# EasyEDA Pro project stm32 Project.eprj

# Schematic Schematic1
Create Date: 2022-09-03; Page Name: stm32; Project Name: stm32 Project; Schematic Name: Schematic1; Update Date: 2022-09-03
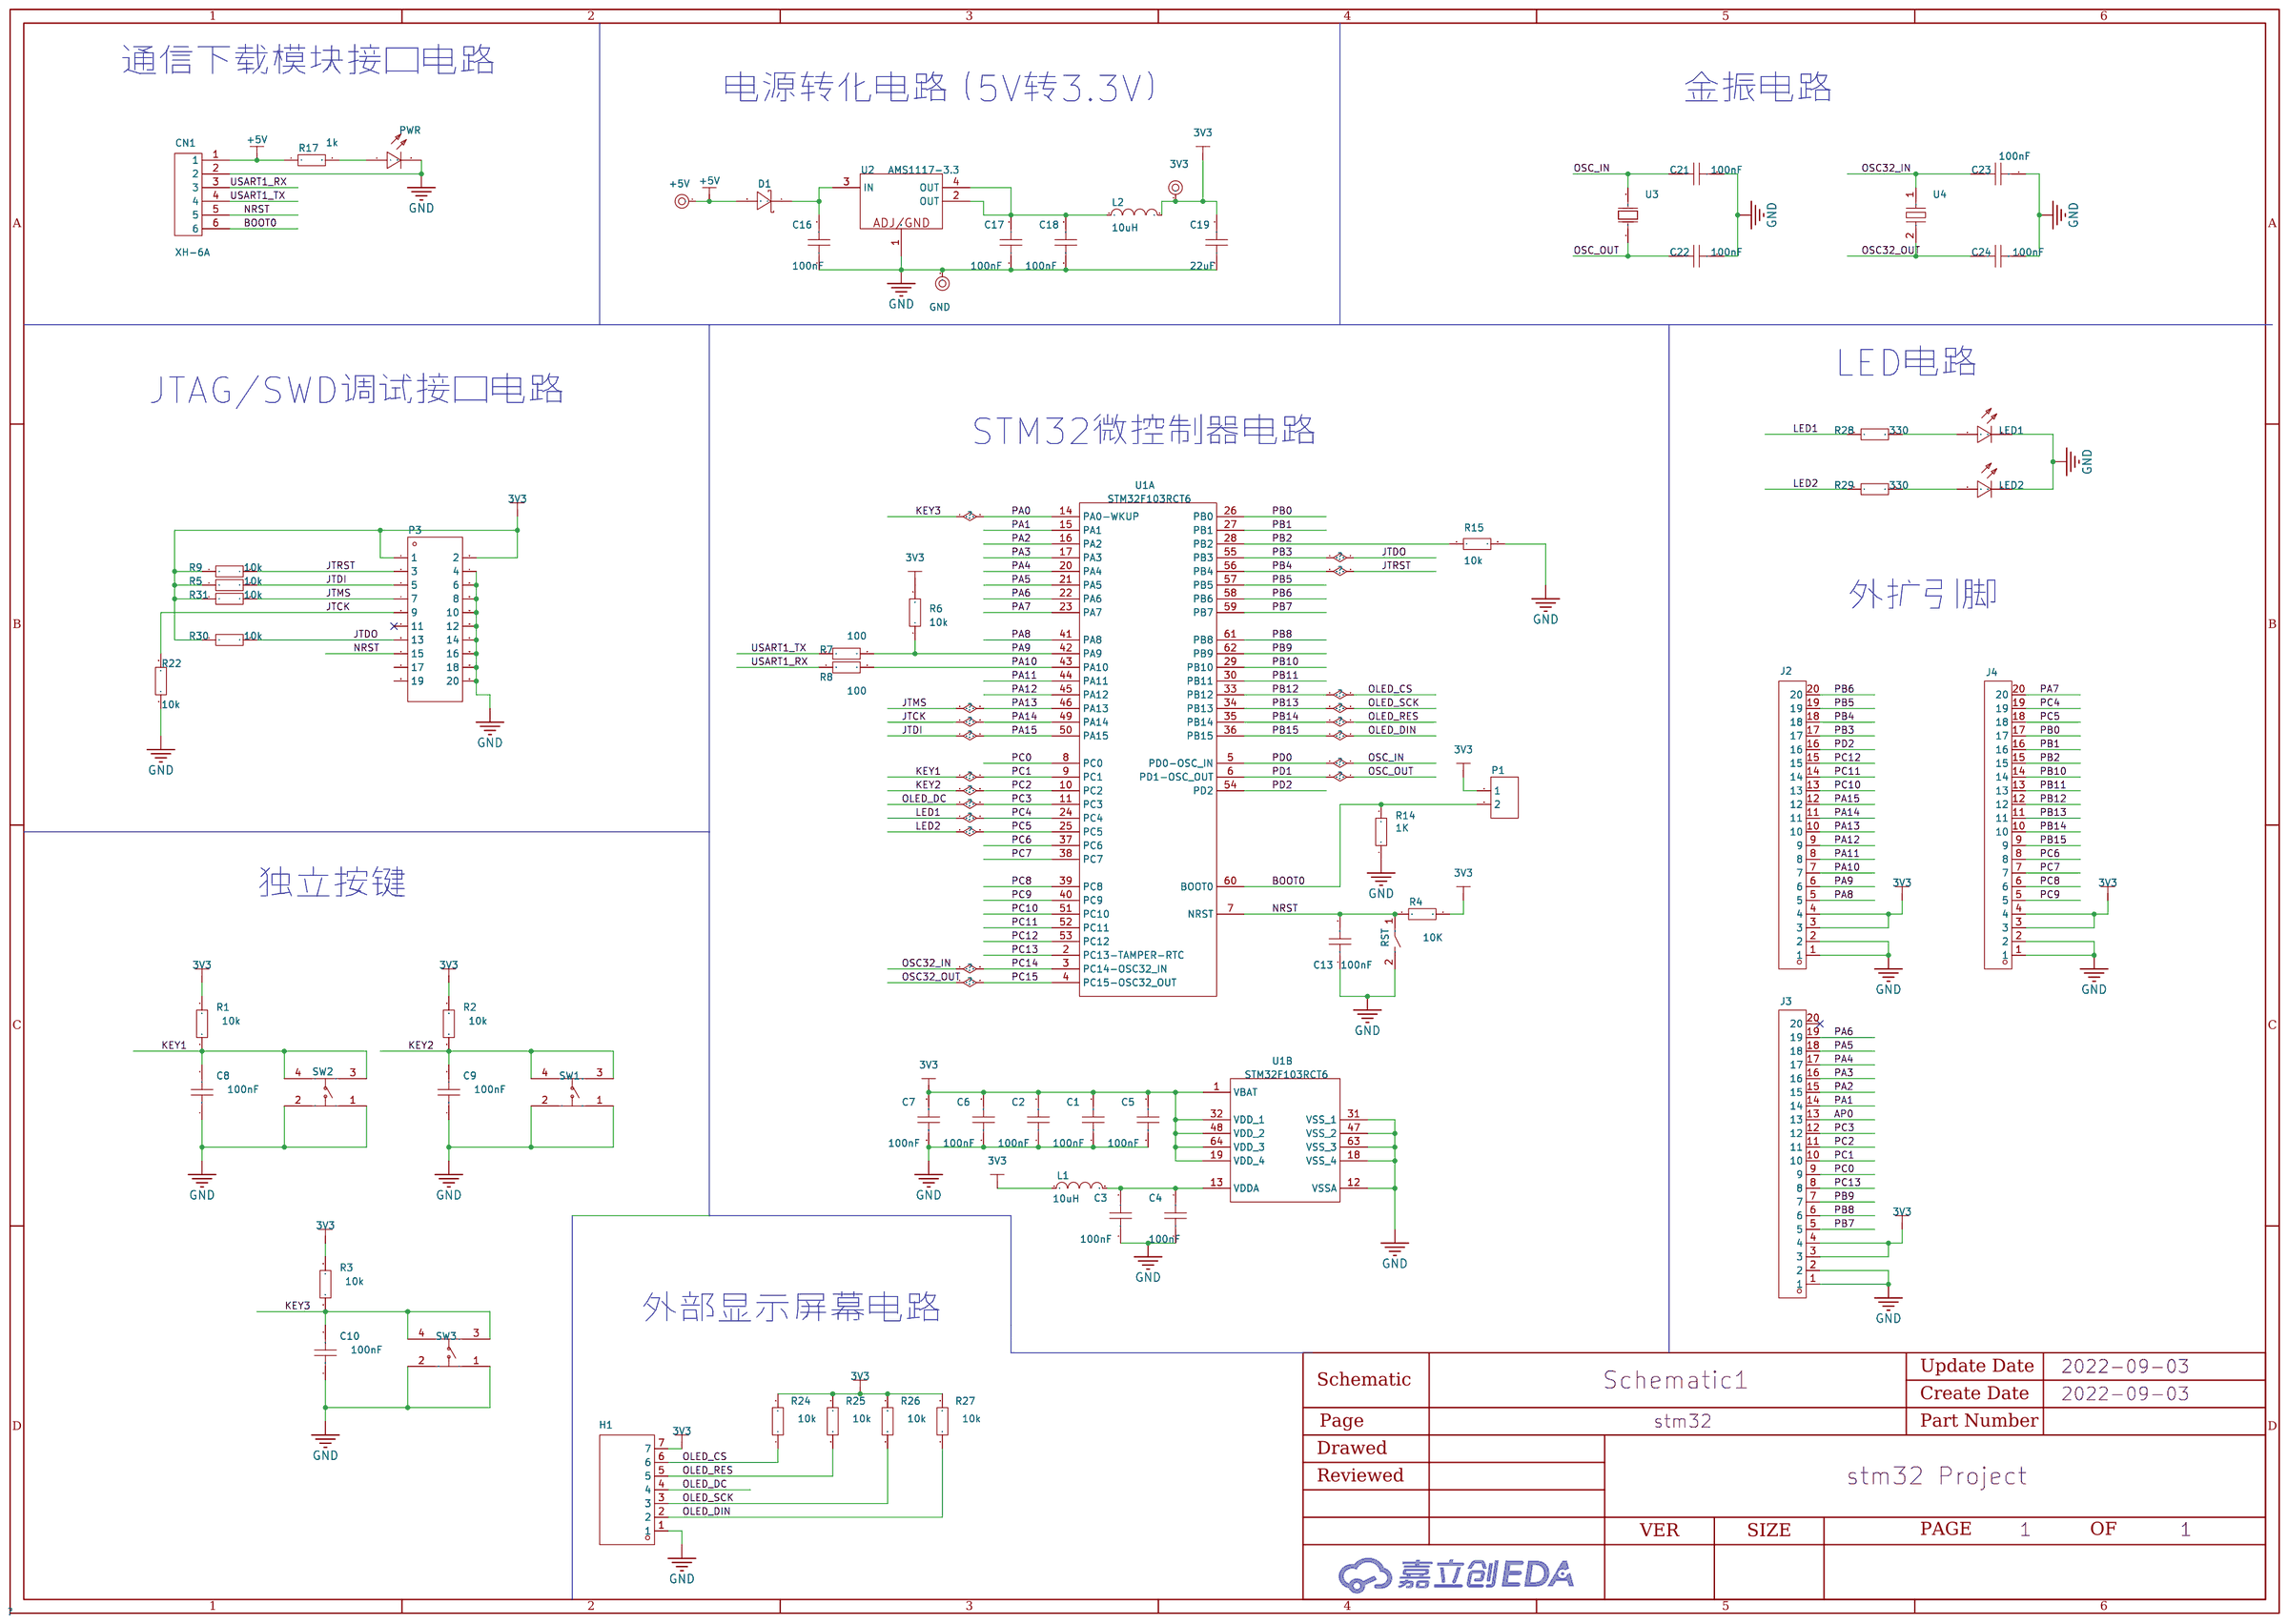
[diagram p0: schematic sheet]

## Parts
3V3  5013  [TESTPOINT-TH_BD3.2-D2.0]
+5V  5013  [TESTPOINT-TH_BD3.2-D2.0]
C1  100nF  [C0603]
C2  100nF  [C0603]
C3  100nF  [C0603]
C4  100nF  [C0603]
C5  100nF  [C0603]
C6  100nF  [C0603]
C7  100nF  [C0603]
C8  100nF  [C0603]
C9  100nF  [C0603]
C10  100nF  [C0603]
C13  100nF  [C0603]
C16  100nF  [C0603]
C17  100nF  [C0603]
C18  100nF  [C0603]
C19  22uF  [C0603]
C21  100nF  [C0603]
C22  100nF  [C0603]
C23  100nF  [C0603]
C24  100nF  [C0603]
CN1  XH-6A  [CONN-TH_6P-P2.50_XH-6A]
D1  SS220  [SMA_L4.4-W2.8-LS5.4-RD]
GND  5013  [TESTPOINT-TH_BD3.2-D2.0]
H1  A2541HWV-7P  [HDR-TH_7P-P2.54-V_A2541HWV-7P]
J2  2.54-1*20P直针  [HDR-TH_20P-P2.54-V-M-1]
J3  2.54-1*20P直针  [HDR-TH_20P-P2.54-V-M-1]
J4  2.54-1*20P直针  [HDR-TH_20P-P2.54-V-M-1]
L1  10uH  [L0603]
L2  10uH  [L0603]
LED1  19-217/GHC-YR1S2/3T  [LED0603-R-RD]
LED2  19-217/GHC-YR1S2/3T  [LED0603-R-RD]
P1  2.54-1*2P母  [HDR-TH_2P-P2.54-V-F]
P3  2.54-2*10P简牛  [IDC-TH_20P-P2.54-V-R2-C10-S2.54_1]
PWR  17-21SURC/S530-A3/TR8  [LED0805-R-RD]
R1  10k  [R0603]
R2  10k  [R0603]
R3  10k  [R0603]
R4  10K  [R0603]
R5  10k  [R0603]
R6  10k  [R0603]
R7  100  [R0603]
R8  100  [R0603]
R9  10k  [R0603]
R14  1K  [R0603]
R15  10k  [R0603]
R17  1k  [R0603]
R22  10k  [R0603]
R24  10k  [R0603]
R25  10k  [R0603]
R26  10k  [R0603]
R27  10k  [R0603]
R28  330  [R0603]
R29  330  [R0603]
R30  10k  [R0603]
R31  10k  [R0603]
RST  YTSB019A0251601B  [SW-SMD_L6.0-W4.0-LS7.3-L]
SW1  K2-6645SP-Q4SC-04  [KEY-SMD_4P-L6.0-W6.0-P4.50-LS9.0]
SW2  K2-6645SP-Q4SC-04  [KEY-SMD_4P-L6.0-W6.0-P4.50-LS9.0]
SW3  K2-6645SP-Q4SC-04  [KEY-SMD_4P-L6.0-W6.0-P4.50-LS9.0]
U1  STM32F103RCT6  [LQFP-64_L10.0-W10.0-P0.50-LS12.0-TL]  (sections 1,2)
U2  AMS1117-3.3  [SOT-223-3_L6.4-W3.5-P2.30-LS7.0-BR]
U3  8MHz  [CRYSTAL-SMD_L6.0-W3.5]
U4  32.768K/12.5PF  [CRYSTAL-SMD_L3.2-W1.5-1]

## Library data of the parts
3V3 +5V GND = 5013: LCSC Part Name: 测试点; Supplier Part: C2906767; Manufacturer: Keystone; Datasheet: https://atta.szlcsc.com/upload/public/pdf/source/20211102/6B22E044790764C1185B316144A1F5B8.pdf; Supplier: LCSC
C1-C10 C13 C16-C19 C21-C24 = CC0603KRX7R9BB104: 容值:100nF;精度:±10%;额定电压:50V;材质(温度系数):X7R;; LCSC Part Name: 100nF ±10% 50V; Supplier Part: C14663; Manufacturer: YAGEO(国巨); Supplier Footprint: 0603; JLCPCB Part Class: Basic Part; Datasheet: https://atta.szlcsc.com/upload/public/pdf/source/20170116/1484561234239.pdf; Supplier: LCSC; Tolerance: ±10%; Voltage Rated: 50V; Temperature Coefficient: X7R
CN1 = XH-6A_1: 参考系列:XH;间距:2.5mm;插针结构:1x6P;排数:1;每排PIN数:6;行距:-;安装方式:-;触头材质:-;; LCSC Part Name: XH-6A,6P,脚距2.5mm,直插 直插; Supplier Part: C5663; Manufacturer: BOOMELE(博穆精密); Supplier Footprint: 插件,P=2.5mm; Datasheet: https://atta.szlcsc.com/upload/public/pdf/source/20151222/1457707648819.pdf; Supplier: LCSC; Reference Series: XH; Pitch: 2.5mm; Pins Structure: 1x6P; Number of Rows: 1; Number of PINs Per Row: 6
D1 = SS220: 直流反向耐压(Vr):200V;平均整流电流(Io):2A;正向压降(Vf):550mV@2A;; LCSC Part Name: 200V 2A 550mV@2A; Supplier Part: C169420; Manufacturer: 晶导微电子; Supplier Footprint: SMA(DO-214AC); Datasheet: https://atta.szlcsc.com/upload/public/pdf/source/20180316/6D53E89B2A4F823A771FF464E8688D75.pdf; Supplier: LCSC; Reverse Voltage (Vr): 200V; Average Rectified Current (Io): 2A; Forward Voltage (Vf@If): 550mV@2A
H1 = A2541HWV-7P: 间距:2.54mm;总孔位数:7;排数:1;插孔结构:1x7P;行距:-;安装类型:直插;塑高:-;触头材质:黄铜;触头镀层:金;; LCSC Part Name: 2.54mm 1x7P; Supplier Part: C225504; Manufacturer: CJT(长江连接器); Supplier Footprint: 直插,P=2.54mm; Datasheet: https://atta.szlcsc.com/upload/public/pdf/source/20180509/C225504_4BDD47D2C090B41BD9BEC6AFDA509326.pdf; Supplier: LCSC; Pitch: 2.54mm; Number of Holes: 7; Number of Rows: 1; Holes Structure: 1x7P; Mounting Type: 直插; Contact Material: 黄铜; Contact Plating: 金
J2-J4 = 2.54-1*20P直针: 间距:2.54mm;总PIN位数:20;排数:1;插针结构:1x20P;行距:-;安装类型:直插;圆针/方针:方针;额定电流:3A;额定电压:-;配合针长度:-;塑高:-;端接针长度:-;触头材质:黄铜;触头镀层:-;工作温度范围:-40~+105;颜色:黑色;; LCSC Part Name: 2.54mm 1x20P 直插 方针; Supplier Part: C50981; Manufacturer: BOOMELE(博穆精密); Supplier Footprint: 插件,P=2.54mm; JLCPCB Part Class: Extended Part; Datasheet: https://atta.szlcsc.com/upload/public/pdf/source/20151109/1457707571495.pdf; Supplier: LCSC; Pitch: 2.54mm; Number of Pins: 20; Number of Rows: 1; Pin Structure: 1x20P; Mounting Type: 直插; Circluar Pins/Square Pins: 方针; Current Rating (Max): 3A; Contact Material: 黄铜; Operating Temperature Range: -40~+105; Color: 黑色
L1 L2 = SDFL1608S100KTF: 额定电流:3mA;电感值:10uH;精度:±10%;直流电阻(DCR):1.85;; LCSC Part Name: 10uH ±10%; Supplier Part: C1035; Manufacturer: Sunlord(顺络); Supplier Footprint: 0603; JLCPCB Part Class: Basic Part; Datasheet: https://atta.szlcsc.com/upload/public/pdf/source/20140222/1457706791092.pdf; Supplier: LCSC; Rated Current: 3mA; Tolerance: ±10%; DC Resistance (DCR): 1.85
LED1 LED2 = 19-217/GHC-YR1S2/3T: 照明颜色:翠绿;色温 - CCT（K）:-;主波长/色坐标:520~535nm;; LCSC Part Name: 翠绿LED; Supplier Part: C72043; Manufacturer: EVERLIGHT(台湾亿光); Supplier Footprint: 0603; JLCPCB Part Class: Basic Part; Datasheet: https://atta.szlcsc.com/upload/public/pdf/source/20160507/1462613613780.pdf; Supplier: LCSC; Mounting Type: 表面贴装; Illumination Color: 翠绿; Luminous Intensity (IF=20mA): 112~258mcd; Dominant Wavelength / Coordinate rank: 520~535nm
P1 = 2.54-1*2P母: 间距:2.54mm;总孔位数:2;排数:1;插孔结构:1x2P;行距:-;安装类型:直插;塑高:-;触头材质:-;触头镀层:-;; LCSC Part Name: 2.54mm 1x2P; Supplier Part: C49661; Manufacturer: BOOMELE(博穆精密); Supplier Footprint: 直插,P=2.54mm; JLCPCB Part Class: Extended Part; Datasheet: https://atta.szlcsc.com/upload/public/pdf/source/20151109/1457707570988.pdf; Supplier: LCSC; Pitch: 2.54mm; Number of Holes: 2; Number of Rows: 1; Holes Structure: 1x2P; Mounting Type: 直插
P3 = 2.54-2*10P简牛_1: 连接器类型:简牛座;间距:2.54mm;排数:2;行距:2.54mm;封装形式:直插;触头材质:-;触头镀层:-;; LCSC Part Name: 2.54mm 排数:2 2*10P; Supplier Part: C3405; Manufacturer: BOOMELE(博穆精密); Supplier Footprint: 直插,P=2.54mm; JLCPCB Part Class: Extended Part; Datasheet: https://atta.szlcsc.com/upload/public/pdf/source/20140331/1457707037878.pdf; Supplier: LCSC; Connector Type: 简牛座; Pitch: 2.54mm; Number of Rows: 2; Row Spacing: 2.54mm; Holder Type: 直插
PWR = 17-21SURC/S530-A3/TR8: 发光颜色:橙红;二极管配置:-;透镜颜色:无色透明;主波长:624nm;峰值波长:632nm;色温:-;光通量(25时):-;测试电流:20mA;正向电压(VF):2V;发光强度:61mcd;功率:60mW;发光角度:140°;安装方式:-;工作温度:-40~+85;; LCSC Part Name: 橙红; Supplier Part: C72037; Manufacturer: EVERLIGHT(台湾亿光); Supplier Footprint: 0805; JLCPCB Part Class: Extended Part; Datasheet: https://atta.szlcsc.com/upload/public/pdf/source/20160507/1462613613540.pdf; Supplier: LCSC; Emitted Color: 橙红; Lens Color: 无色透明; Dominant Wavelength: 624nm; Peak Wavelength: 632nm; Forward Current: 20mA; Forward Voltage (VF): 2V; Luminous Intensity: 61mcd; Power Dissipation: 60mW; Viewing Angle: 140°; Operating Temperature: -40~+85
R1-R9 R14 R15 R17 R22 R24-R31 = TR0603B10K0P0525Z: 阻值:10k;精度:±0.1%;温度系数:±25ppm/;功率:100mW;工作温度范围:-55~+155;电阻类型:薄膜电阻;最大工作电压:75V;; LCSC Part Name: 10k ±0.1%; Supplier Part: C188363; Manufacturer: EVER OHMS(天二科技); Supplier Footprint: 0603; JLCPCB Part Class: Extended Part; Datasheet: https://atta.szlcsc.com/upload/public/pdf/source/20190415/C188363_433BF05B6FB8F7A0F5F35A3E4390C55A.pdf; Supplier: LCSC; Tolerance: ±0.1%; Temperature Coefficient: ±25ppm/; Power(Watts): 100mW; Operating Temperature Range: -55~+155; Type: 薄膜电阻; Overload Voltage (Max): 75V
RST = YTSB019A0251601B: 触点电流:50mA;额定电压(DC):12V;绝缘电阻:100M;电路结构:单刀单掷;安装方式:立贴;按钮形状:圆形按钮;按钮/盖帽颜色:黑色;作用力:160gf;机械寿命:30000;防护等级:IP67;引脚样式:SMD接片;开关长度:6mm;开关宽度:4mm;开关高度:2.5mm;带支架:否;; Supplier Part: C2844406; Manufacturer: DGBZ(东莞博众); Supplier Footprint: SMD,4x6x2.5mm; Datasheet: https://atta.szlcsc.com/upload/public/pdf/source/20210709/C2844406_F5FA1D284AC4E3E07B17B8294B8DFACF.pdf; Supplier: LCSC; Contact Current: 50mA; Voltage Rating (DC): 12V; Insulation Resistance: 100M; Circuit: 单刀单掷; Mounting Style: 立贴; Actuator Style: 圆形按钮; Actuator/Cap Color: 黑色; Operating Force: 160gf; Mechanical Life: 30000; IP Rating: IP67; Pin Style: SMD接片; Switch Length: 6mm; Switch Width: 4mm; Switch Height: 2.5mm; Strike Gundam: 否
SW1-SW3 = K2-6645SP-Q4SC-04: 触点电流:50mA;额定电压(DC):12V;绝缘电阻:100M;安装方式:立贴;作用力:250gf@±30gf;机械寿命:1000000;工作温度:-25~+85;开关长度:6mm;开关宽度:6mm;开关高度:12mm;; LCSC Part Name: 6*6加高贴片 H12; Supplier Part: C840341; Manufacturer: 韩国韩荣; Supplier Footprint: SMD; Datasheet: https://atta.szlcsc.com/upload/public/pdf/source/20210810/0C36E7350988D004DBEEF8DA4B4D7915.pdf; Supplier: LCSC; Contact Current: 50mA; Voltage Rating (DC): 12V; Insulation Resistance: 100M; Mounting Style: 立贴; Operating Force: 250gf@±30gf; Mechanical Life: 1000000; Operating Temperature: -25~+85; Switch Length: 6mm; Switch Width: 6mm; Switch Height: 12mm
U1 = STM32F103RCT6TR: 主频（MAX):72MHz;工作电压:2V ~ 3.6V;; Supplier Part: C39704; Manufacturer: ST(意法半导体); Supplier Footprint: LQFP-64_10x10x05P; Datasheet: https://atta.szlcsc.com/upload/public/pdf/source/20151012/1457707442737.pdf; Supplier: LCSC; Speed: 72MHz; Voltage - Supply (Vcc/Vdd): 2V ~ 3.6V; Program Memory Size: 256KB; RAM Size: 48KB; Number of I/O: 51; A/D: 16x12bit; D/A: 2x12bit; PWM: 18; LCD: LCD parallel interface, 8080/6800 modes; UART/USART: 3 USART+2 UART; SPI: 3; I2C（SMBUS/PMBUS）: 2; USB Device: 1; CAN: 1
U2 = AMS1117-3.3_C2992570: Supplier Part: C2992570; Manufacturer: 国芯佳品; Supplier Footprint: SOT-223; Datasheet: https://atta.szlcsc.com/upload/public/pdf/source/20220729/0D21C21EC310E4778671BF6BAE438640.pdf; Supplier: LCSC
U3 = 8MHz: Supplier Part: C9900009661; Supplier Footprint: OSC6035-2P; Datasheet: https://atta.szlcsc.comnull; Supplier: LCSC
U4 = 32.768K/12.5PF: Supplier Part: C9900014970; Supplier Footprint: 32.768KHz; Datasheet: https://atta.szlcsc.comnull; Supplier: LCSC

## Nets
3V3: 3V3.1 C1.2 C2.2 C5.2 C6.2 C7.2 C19.2 H1.7 J2.3 J2.4 J3.3 J3.4 J4.3 J4.4 L1.1 L2.2 P1.1 P3.1 P3.2 R1.2 R2.2 R3.2 R4.2 R5.1 R6.2 R9.1 R24.2 R25.2 R26.2 R27.2 R30.1 R31.1 U1.1(VBAT) U1.19(VDD_4) U1.32(VDD_1) U1.48(VDD_2) U1.64(VDD_3)
+5V: +5V.1 CN1.1 D1.2 R17.1
GND: C1.1 C2.1 C3.1 C4.1 C5.1 C6.1 C7.1 C8.1 C9.1 C10.1 C13.1 C16.1 C17.1 C18.1 C19.1 C21.2 C22.2 C23.2 C24.2 CN1.2 GND.1 H1.1 J2.1 J2.2 J3.1 J3.2 J4.1 J4.2 LED1.2(C) LED2.2(C) P3.4 P3.6 P3.8 P3.10 P3.12 P3.14 P3.16 P3.18 P3.20 PWR.2(C) R14.1 R15.2 R22.1 RST.2 SW1.1 SW1.2 SW2.1 SW2.2 SW3.1 SW3.2 U1.12(VSSA) U1.18(VSS_4) U1.31(VSS_1) U1.47(VSS_2) U1.63(VSS_3) U2.1(ADJ/GND)
AP0: J3.13
BOOT0: CN1.6 P1.2 R14.2 U1.60(BOOT0)
JTCK: J2.11 P3.9 R22.2 U1.49(PA14)
JTDI: J2.12 P3.5 R5.2 U1.50(PA15)
JTDO: J2.17 P3.13 R30.2 U1.55(PB3)
JTMS: J2.10 P3.7 R31.2 U1.46(PA13)
JTRST: J2.18 P3.3 R9.2 U1.56(PB4)
KEY1: C8.2 J3.10 R1.1 SW2.3 SW2.4 U1.9(PC1)
KEY2: C9.2 J3.11 R2.1 SW1.3 SW1.4 U1.10(PC2)
KEY3: C10.2 R3.1 SW3.3 SW3.4 U1.14(PA0-WKUP)
LED1: J4.19 R28.1 U1.24(PC4)
LED2: J4.18 R29.1 U1.25(PC5)
NRST: C13.2 CN1.5 P3.15 R4.1 RST.1 U1.7(NRST)
OLED_CS: H1.6 J4.12 R24.1 U1.33(PB12)
OLED_DC: H1.4 J3.12 U1.11(PC3)
OLED_DIN: H1.2 J4.9 R27.1 U1.36(PB15)
OLED_RES: H1.5 J4.10 R25.1 U1.35(PB14)
OLED_SCK: H1.3 J4.11 R26.1 U1.34(PB13)
OSC32_IN: C23.1 U1.3(PC14-OSC32_IN) U4.1
OSC32_OUT: C24.1 U1.4(PC15-OSC32_OUT) U4.2
OSC_IN: C21.1 U1.5(PD0-OSC_IN) U3.2(OSC2)
OSC_OUT: C22.1 U1.6(PD1-OSC_OUT) U3.1(OSC1)
PA1: J3.14 U1.15(PA1)
PA2: J3.15 U1.16(PA2)
PA3: J3.16 U1.17(PA3)
PA4: J3.17 U1.20(PA4)
PA5: J3.18 U1.21(PA5)
PA6: J3.19 U1.22(PA6)
PA7: J4.20 U1.23(PA7)
PA8: J2.5 U1.41(PA8)
PA9: J2.6 R6.1 R7.2 U1.42(PA9)
PA10: J2.7 R8.2 U1.43(PA10)
PA11: J2.8 U1.44(PA11)
PA12: J2.9 U1.45(PA12)
PB0: J4.17 U1.26(PB0)
PB1: J4.16 U1.27(PB1)
PB2: J4.15 R15.1 U1.28(PB2)
PB5: J2.19 U1.57(PB5)
PB6: J2.20 U1.58(PB6)
PB7: J3.5 U1.59(PB7)
PB8: J3.6 U1.61(PB8)
PB9: J3.7 U1.62(PB9)
PB10: J4.14 U1.29(PB10)
PB11: J4.13 U1.30(PB11)
PC0: J3.9 U1.8(PC0)
PC6: J4.8 U1.37(PC6)
PC7: J4.7 U1.38(PC7)
PC8: J4.6 U1.39(PC8)
PC9: J4.5 U1.40(PC9)
PC10: J2.13 U1.51(PC10)
PC11: J2.14 U1.52(PC11)
PC12: J2.15 U1.53(PC12)
PC13: J3.8 U1.2(PC13-TAMPER-RTC)
PD2: J2.16 U1.54(PD2)
USART1_RX: CN1.3 R8.1
USART1_TX: CN1.4 R7.1
$1N6990: C3.2 C4.2 L1.2 U1.13(VDDA)
$1N7842: C16.2 D1.1 U2.3(IN)
$1N8958: C17.2 C18.2 L2.1 U2.2(OUT) U2.4(OUT)
$1N13058: PWR.1(A) R17.2
$1N53053: LED1.1(A) R28.2
$1N53386: LED2.1(A) R29.2

Not connected (* = marked no-connect by the designer): J3 20*; P3 11* 17 19

## Notes on the sheet
- 通信下载模块接口电路
- 电源转化电路（5V转3.3V）
- 金振电路
- LED电路
- JTAG/SWD调试接口电路
- STM32微控制器电路
- 外扩引脚
- 独立按键
- 外部显示屏幕电路

# Board PCB1
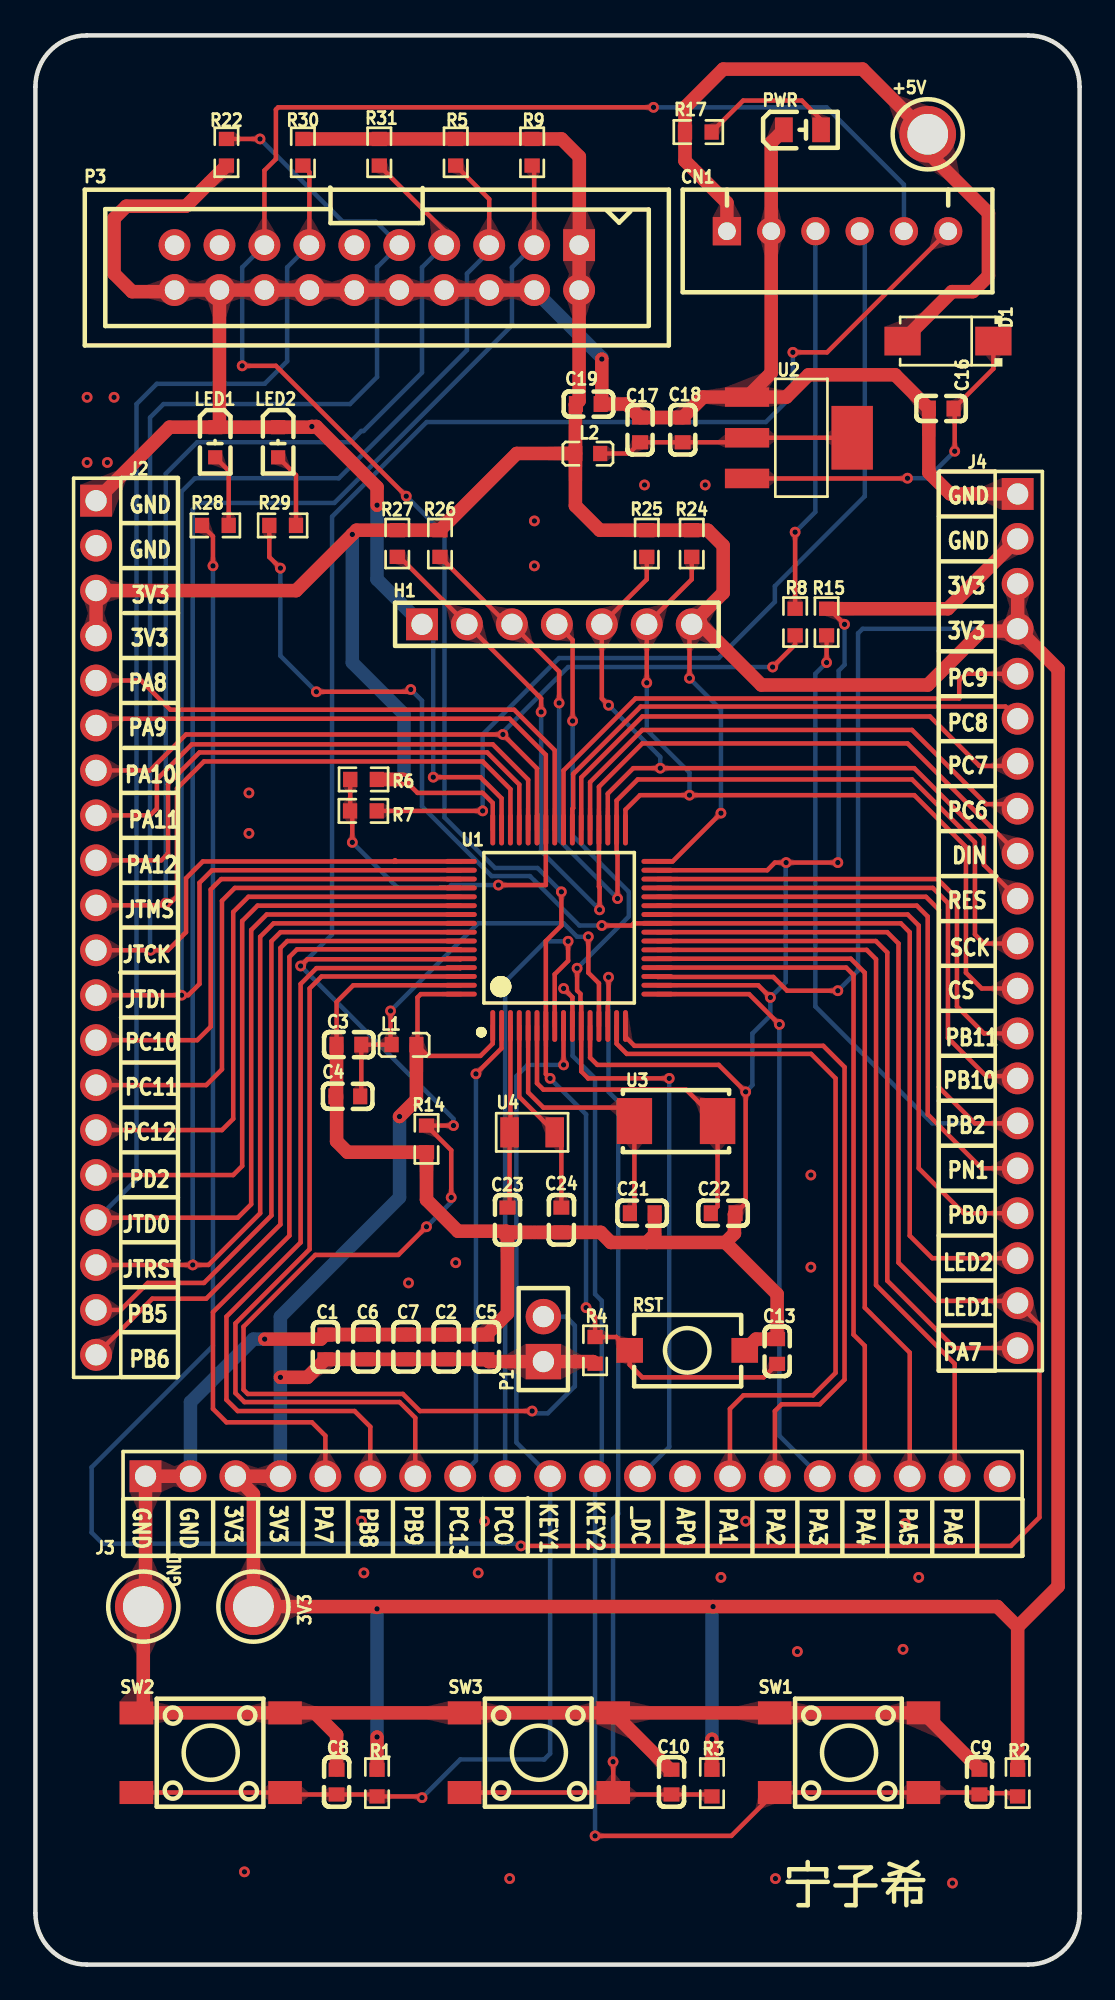
[diagram p1: board, top side]
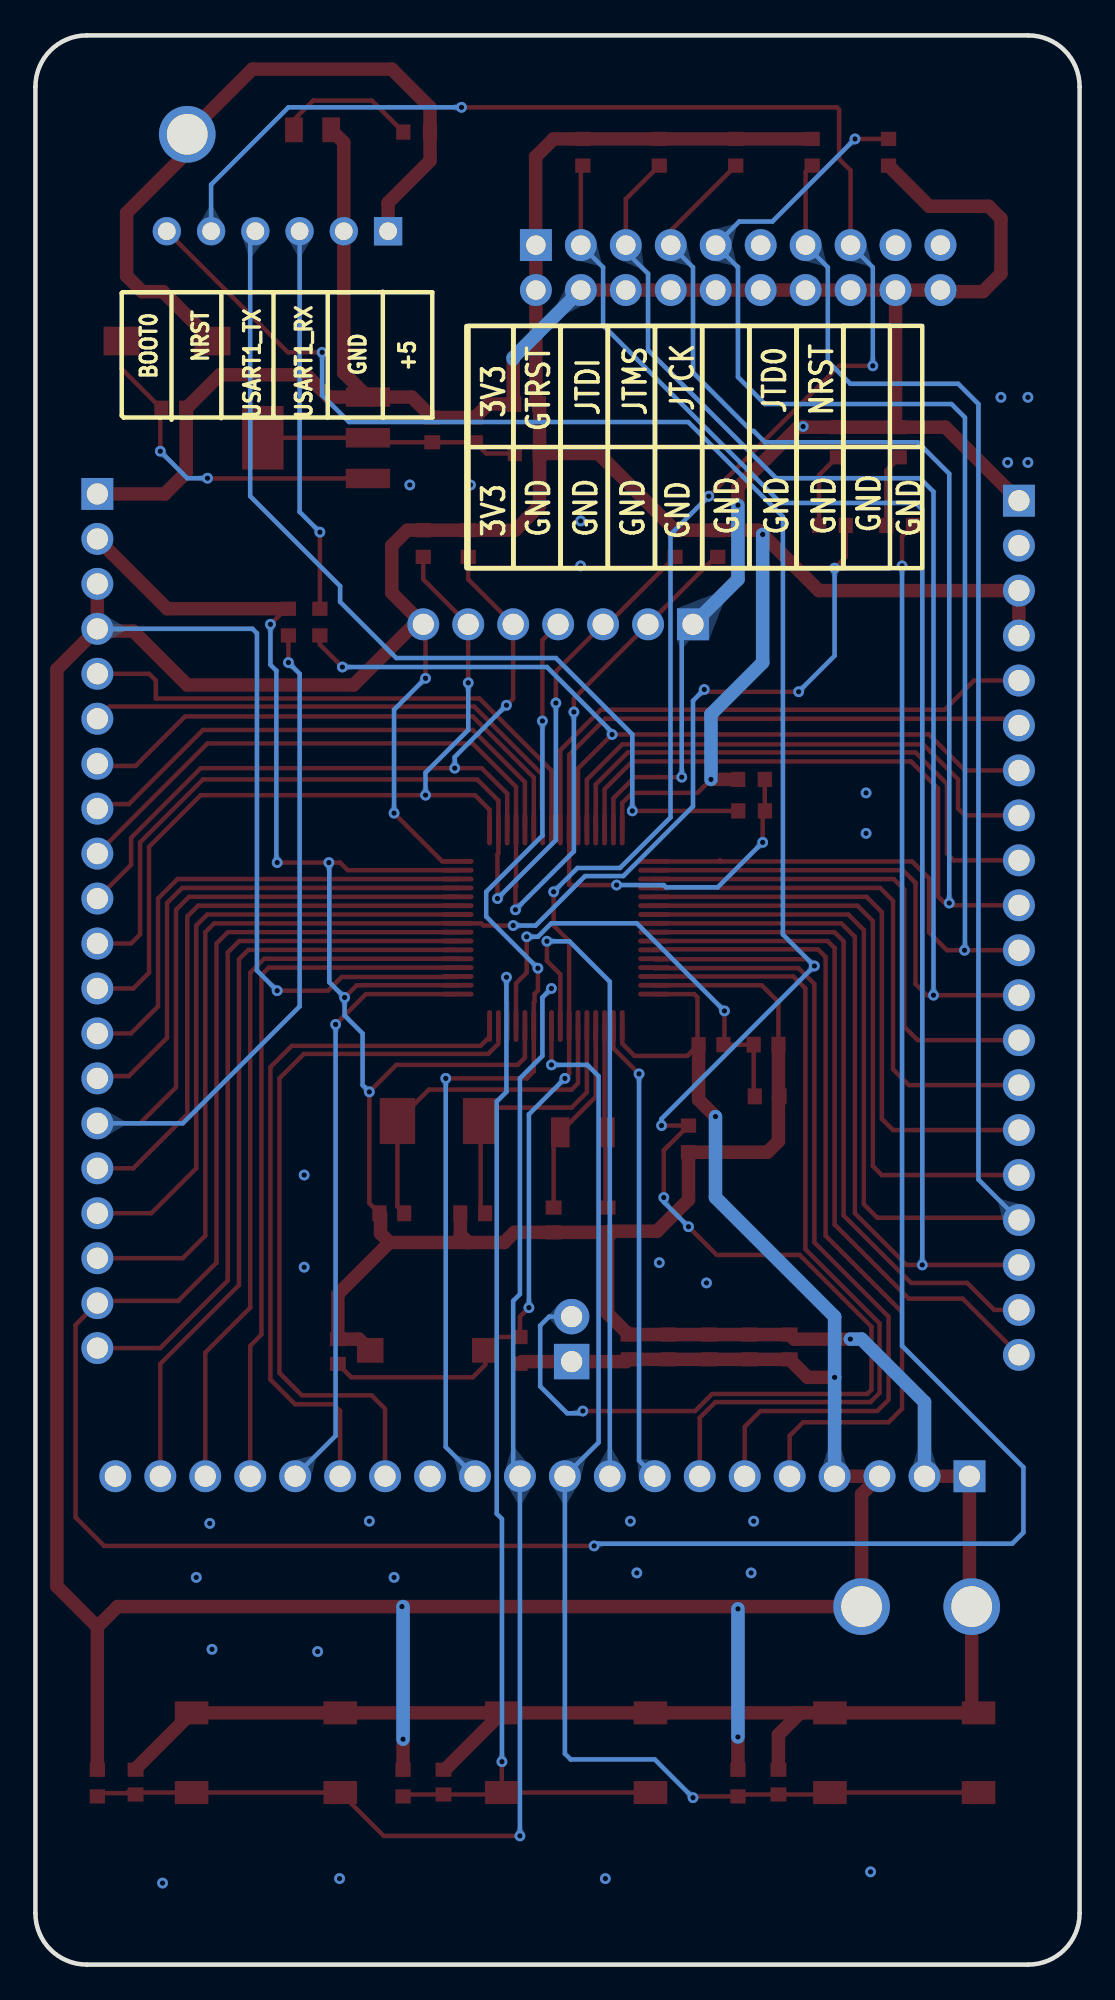
[diagram p2: board, bottom side, seen from below]

Outline 59 x 109 mm; copper layers: Top Layer, Bottom Layer. Coordinates in mm from the lower left corner of the outline.
Outline path: 0,106.1 0,2.9 arc(0.85,0.85) 2.9,0 56.1,0 arc(58.15,0.85) 59,2.9 59,106.1 arc(58.15,108.15) 56.1,109 2.9,109 arc(0.85,108.15) 0,106.1
Stack: Top Layer 0.035mm / 介电1 1.51mm FR4 er 4.5 / Bottom Layer 0.035mm

## Design rules (mm)
spacing safeClearance (default): track to track 0.203, other pairs 0.203 to 0.203
track width trackWidth (default): min 0.254, default 0.254, max 0.762
track width VCC: min 0.254, default 0.762, max 0.762
differential pair differentialPair (default): width min 0.127, default 0.254, max 2.54; gap min 0.152, default 0.152
via viaSize (default): diameter min 0.5, default 0.61, max 10; hole min 0.3, default 0.305, max 5.999
net GND uses VCC
net 3V3 uses VCC
net +5V uses VCC

## Placement (name value [footprint] x y rotation side)
3V3  5013  [TESTPOINT-TH_BD3.2-D2.0]  12.32 20.23 0 top
+5V  5013  [TESTPOINT-TH_BD3.2-D2.0]  50.42 103.41 0 top
C1  100nF  [C0603]  16.38 34.9 270 top
C2  100nF  [C0603]  23.21 34.9 270 top
C3  100nF  [C0603]  17.72 51.98 0 top
C4  100nF  [C0603]  17.65 49.06 0 top
C5  100nF  [C0603]  25.48 34.9 270 top
C6  100nF  [C0603]  18.66 34.9 270 top
C7  100nF  [C0603]  20.93 34.9 270 top
C8  100nF  [C0603]  17.02 10.31 270 top
C9  100nF  [C0603]  53.34 10.31 270 top
C10  100nF  [C0603]  35.94 10.31 270 top
C13  100nF  [C0603]  41.91 34.64 270 top
C16  100nF  [C0603]  51.18 87.92 0 top
C17  100nF  [C0603]  34.16 86.71 270 top
C18  100nF  [C0603]  36.58 86.71 270 top
C19  22uF  [C0603]  31.24 88.17 180 top
C21  100nF  [C0603]  34.29 42.45 0 top
C22  100nF  [C0603]  38.86 42.45 0 top
C23  100nF  [C0603]  26.67 42.07 270 top
C24  100nF  [C0603]  29.72 42.07 270 top
CN1  XH-6A  [CONN-TH_6P-P2.50_XH-6A]  45.32 97.94 0 top
D1  SS220  [SMA_L4.4-W2.8-LS5.4-RD]  51.56 91.73 180 top
GND  5013  [TESTPOINT-TH_BD3.2-D2.0]  6.1 20.23 0 top
H1  A2541HWV-7P  [HDR-TH_7P-P2.54-V_A2541HWV-7P]  29.46 75.73 0 top
J2  2.54-1*20P直针  [HDR-TH_20P-P2.54-V-M-1]  3.43 58.58 270 top
J3  2.54-1*20P直针  [HDR-TH_20P-P2.54-V-M-1]  30.35 27.59 0 top
J4  2.54-1*20P直针  [HDR-TH_20P-P2.54-V-M-1]  55.5 58.96 270 top
L1  10uH  [L0603]  20.83 51.98 180 top
L2  10uH  [L0603]  31.21 85.38 180 top
LED1  19-217/GHC-YR1S2/3T  [LED0603-R-RD]  10.16 86.01 270 top
LED2  19-217/GHC-YR1S2/3T  [LED0603-R-RD]  13.72 86.01 270 top
P1  2.54-1*2P母  [HDR-TH_2P-P2.54-V-F]  28.7 35.34 90 top
P3  2.54-2*10P简牛  [IDC-TH_20P-P2.54-V-R2-C10-S2.54_1]  19.29 95.88 180 top
PWR  17-21SURC/S530-A3/TR8  [LED0805-R-RD]  43.34 103.67 0 top
R1  10k  [R0603]  19.3 10.26 90 top
R2  10k  [R0603]  55.5 10.26 90 top
R3  10k  [R0603]  38.23 10.26 90 top
R4  10K  [R0603]  31.62 34.7 270 top
R5  10k  [R0603]  23.75 102.4 270 top
R6  10k  [R0603]  18.54 66.96 0 top
R7  100  [R0603]  18.53 65.19 180 top
R8  100  [R0603]  42.93 75.85 270 top
R9  10k  [R0603]  28.07 102.4 270 top
R14  1K  [R0603]  22.1 46.65 90 top
R15  10k  [R0603]  44.7 75.85 90 top
R17  1k  [R0603]  37.46 103.54 0 top
R22  10k  [R0603]  10.79 102.4 90 top
R24  10k  [R0603]  37.08 80.29 90 top
R25  10k  [R0603]  34.54 80.29 90 top
R26  10k  [R0603]  22.86 80.29 90 top
R27  10k  [R0603]  20.45 80.29 90 top
R28  330  [R0603]  10.17 81.31 0 top
R29  330  [R0603]  13.97 81.31 0 top
R30  10k  [R0603]  15.11 102.4 270 top
R31  10k  [R0603]  19.43 102.4 270 top
RST  YTSB019A0251601B  [SW-SMD_L6.0-W4.0-LS7.3-L]  36.83 34.7 0 top
SW1  K2-6645SP-Q4SC-04  [KEY-SMD_4P-L6.0-W6.0-P4.50-LS9.0]  45.97 11.97 0 top
SW2  K2-6645SP-Q4SC-04  [KEY-SMD_4P-L6.0-W6.0-P4.50-LS9.0]  9.91 11.97 0 top
SW3  K2-6645SP-Q4SC-04  [KEY-SMD_4P-L6.0-W6.0-P4.50-LS9.0]  28.45 11.97 0 top
U1  STM32F103RCT6  [LQFP-64_L10.0-W10.0-P0.50-LS12.0-TL]  29.59 58.58 90 top
U2  AMS1117-3.3  [SOT-223-3_L6.4-W3.5-P2.30-LS7.0-BR]  43.18 86.27 180 top
U3  8MHz  [CRYSTAL-SMD_L6.0-W3.5]  36.19 47.66 180 top
U4  32.768K/12.5PF  [CRYSTAL-SMD_L3.2-W1.5-1]  28.07 47.02 0 top

## Footprints (pads in the part's own frame, mm; a bottom-side part is the same pattern mirrored in y, then rotated)
C0603
  rect 0.8x0.9 smd: 1(-0.7,0) 2(0.7,0)
CONN-TH_6P-P2.50_XH-6A
  rect 1.6x1.6 hole 1.001: 1(-6.251,0)
  round 1.6 hole 1.001: 2(-3.749,0) 3(-1.25,0) 4(1.25,0) 5(3.749,0) 6(6.251,0)
CRYSTAL-SMD_L3.2-W1.5-1
  rect 1.049x1.7 smd: 1(-1.275,0) 2(1.275,0)
CRYSTAL-SMD_L6.0-W3.5
  rect 2x2.6 smd: 1(-2.35,0) 2(2.35,0)
HDR-TH_2P-P2.54-V-F
  rect 1.999x1.999 hole 1.199: 1(-1.27,0)
  round 1.999 hole 1.199: 2(1.27,0)
HDR-TH_7P-P2.54-V_A2541HWV-7P
  rect 1.801x1.801 hole 1.199: 1(-7.62,0)
  round 1.801 hole 1.199: 2(-5.08,0) 3(-2.54,0) 4(0,0) 5(2.54,0) 6(5.08,0) 7(7.62,0)
HDR-TH_20P-P2.54-V-M-1
  rect 1.801x1.801 hole 1.199: 1(-24.13,0)
  round 1.801 hole 1.199: 2(-21.59,0) 3(-19.05,0) 4(-16.51,0) 5(-13.97,0) 6(-11.43,0) 7(-8.89,0) 8(-6.35,0) 9(-3.81,0) 10(-1.27,0) 11(1.27,0) 12(3.81,0) 13(6.35,0) 14(8.89,0) 15(11.43,0) 16(13.97,0) 17(16.51,0) 18(19.05,0) 19(21.59,0) 20(24.13,0)
IDC-TH_20P-P2.54-V-R2-C10-S2.54_1
  rect 1.8x1.8 hole 1.1: 1(-11.43,-1.27)
  round 1.8 hole 1.1: 2(-11.43,1.27) 3(-8.89,-1.27) 4(-8.89,1.27) 5(-6.35,-1.27) 6(-6.35,1.27) 7(-3.81,-1.27) 8(-3.81,1.27) 9(-1.27,-1.27) 10(-1.27,1.27) 11(1.27,-1.27) 12(1.27,1.27) 13(3.81,-1.27) 14(3.81,1.27) 15(6.35,-1.27) 16(6.35,1.27) 17(8.89,-1.27) 18(8.89,1.27) 19(11.43,-1.27) 20(11.43,1.27)
KEY-SMD_4P-L6.0-W6.0-P4.50-LS9.0
  rect 1.9x1.3 smd: 1(-4.2,2.25) 2(4.2,2.25) 3(-4.2,-2.25) 4(4.2,-2.25)
L0603
  rect 0.8x0.864 smd: 1(-0.7,0) 2(0.7,0)
LED0603-R-RD
  rect 0.8x0.8 smd: 1(0.851,0) 2(-0.851,0)
LED0805-R-RD
  rect 1x1.399 smd: 1(1.05,0) 2(-1.05,0)
LQFP-64_L10.0-W10.0-P0.50-LS12.0-TL
  oval 1.801x0.28 smd: 1(-5.55,3.749) 2(-5.55,3.251) 3(-5.55,2.751) 4(-5.55,2.251) 5(-5.55,1.75) 6(-5.55,1.25) 7(-5.55,0.75) 8(-5.55,0.249) 9(-5.55,-0.249) 10(-5.55,-0.75) 11(-5.55,-1.25) 12(-5.55,-1.75) 13(-5.55,-2.251) 14(-5.55,-2.751) 15(-5.55,-3.248) 16(-5.55,-3.749) 33(5.55,-3.749) 34(5.55,-3.248) 35(5.55,-2.751) 36(5.55,-2.251) 37(5.55,-1.75) 38(5.55,-1.25) 39(5.55,-0.75) 40(5.55,-0.249) 41(5.55,0.249) 42(5.55,0.75) 43(5.55,1.25) 44(5.55,1.75) 45(5.55,2.251) 46(5.55,2.751) 47(5.55,3.251) 48(5.55,3.749)
  oval 0.28x1.801 smd: 17(-3.749,-5.55) 18(-3.248,-5.55) 19(-2.751,-5.55) 20(-2.251,-5.55) 21(-1.75,-5.55) 22(-1.25,-5.55) 23(-0.75,-5.55) 24(-0.249,-5.55) 25(0.249,-5.55) 26(0.75,-5.55) 27(1.25,-5.55) 28(1.75,-5.55) 29(2.251,-5.55) 30(2.751,-5.55) 31(3.251,-5.55) 32(3.749,-5.55) 49(3.749,5.55) 50(3.251,5.55) 51(2.751,5.55) 52(2.251,5.55) 53(1.75,5.55) 54(1.25,5.55) 55(0.75,5.55) 56(0.249,5.55) 57(-0.249,5.55) 58(-0.75,5.55) 59(-1.25,5.55) 60(-1.75,5.55) 61(-2.251,5.55) 62(-2.751,5.55) 63(-3.248,5.55) 64(-3.749,5.55)
R0603
  rect 0.806x0.864 smd: 1(-0.753,0) 2(0.753,0)
SMA_L4.4-W2.8-LS5.4-RD
  rect 2.046x1.62 smd: 1(-2.566,0) 2(2.566,0)
SOT-223-3_L6.4-W3.5-P2.30-LS7.0-BR
  rect 2.499x1.1 smd: 1(2.97,-2.299) 2(2.97,0) 3(2.97,2.301)
  rect 2.34x3.599 smd: 4(-2.97,0)
SW-SMD_L6.0-W4.0-LS7.3-L
  rect 1.501x1.399 smd: 1(-3.251,0) 2(3.251,0)
TESTPOINT-TH_BD3.2-D2.0
  round 3.2 hole 2.3: 1(0,0)

## Nets
As in the schematic.

Pads without a net: J3 20; P3 11 17 19

## Via types
v1: diameter 0.61, hole 0.305, Top Layer to Bottom Layer, 103 vias

## Routing (per net, layer and track width the routed paths; a pad name or vN(x,y) marks a point on that pad's centre or on a via; arc(x,y) is an arc through that point)
3V3: length 382.8
  Top Layer w0.254: 35.14,55.83 35.17,55.8 41.69,55.8 42.47,55.03 v1(45.34,55.03) ; U1.64 21.78,54.83 21.59,54.64 21.59,52.04 L1.1 22.16,51.34 25.15,51.34 25.84,52.04 U1.1 ; v1(36.96,72.68) 36.96,75.6 ; 35.14,62.33 36.01,62.33 v1(38.74,65.06) ; v1(20.83,66.96) 21.59,66.2 25.27,66.2 25.84,65.63 U1.48
  Top Layer w0.762: v1(13.84,33.18) 15.37,33.18 C1.2 C6.2 C7.2 C2.2 C5.2 25.61,34.07 P1.1 31.5,34.07 R4.2 ; L2.2 30.51,88.14 ; L2.2 30.51,82.42 31.89,81.04 37.99,81.04 38.86,80.17 38.86,77.5 36.96,75.6 H1.7 37.59,75.73 41.02,72.3 50.42,72.3 53.47,75.34 55.37,75.34 J4.4 ; L2.2 27.2,85.38 22.86,81.04 18.14,81.04 v1(17.91,80.81) 14.73,77.63 J2.3 J2.4 ; 30.51,88.14 30.72,88.35 P3.2 P3.1 30.73,97.16 30.73,102.14 29.73,103.15 R9.1 R5.1 R31.1 R30.1 ; 30.51,88.14 C19.2 ; v1(20.57,47.91) 21.53,48.87 L1.1 ; J3.4 J3.3 12.32,26.58 3V3.1 v1(38.29,20.23) 54.36,20.23 55.5,19.08 ; J4.4 57.78,73.19 57.78,21.37 55.5,19.08 ; J4.4 J4.3 ; 55.5,19.08 R2.2 ; R3.2 v1(38.23,12.73) ; R1.2 v1(19.3,12.86) ; R6.2 v1(20.83,66.96)
  Bottom Layer w0.254: v1(38.74,65.06) 38.74,70.9 v1(36.96,72.68) ; v1(45.34,55.03) 46.48,56.17 46.48,75.22 46.74,75.47 J4.4
  Bottom Layer w0.762: v1(20.57,47.91) 20.57,43.34 13.84,36.61 v1(13.84,33.18) J3.4 ; v1(38.23,12.73) 38.23,20.23 ; v1(17.91,80.81) 17.91,73.57 20.83,70.65 v1(20.83,66.96) ; v1(19.3,20.1) v1(19.3,12.86)
+5V: length 39.9
  Top Layer w0.762: CN1.1 39.07,99.54 36.7,101.91 R17.1 36.7,104.94 38.86,107.09 46.74,107.09 +5V.1 50.42,102.4 53.85,98.97 53.85,95.41 52.96,94.52 51.79,94.52 D1.2
GND: length 372.5
  Top Layer w0.254: U1.63 17.96,55.33 17.02,54.39 17.02,51.98 C3.1 ; U1.12 31.34,51.24 31.75,50.83 38.61,50.83 v1(40.13,49.31) 40.13,43.02 C22.2 ; v1(41.53,54.64) 40.84,55.33 35.14,55.33 ; v1(22.48,67.09) 25.15,67.09 26.34,65.9 U1.47 ; v1(45.72,75.73) 44.84,76.61 ; v1(45.34,62.26) v1(42.42,62.26) 41.78,62.26 41.35,61.83 35.14,61.83
  Top Layer w0.762: P3.18 P3.16 P3.14 P3.12 P3.10 P3.8 P3.6 P3.4 ; P3.18 10.4,87.11 LED1.2 ; P3.18 P3.20 7.77,94.52 5.46,94.52 4.44,95.54 4.44,98.66 5.14,99.35 8.5,99.35 R22.1 ; SW3.2 SW1.1 SW1.2 53.34,11.06 C9.1 ; SW3.2 35.86,11.01 C10.1 ; SW3.2 SW3.1 15.78,14.22 ; 38.99,40.8 41.91,37.88 C13.1 40.72,35.34 40.08,34.7 ; 38.99,40.8 39.5,41.31 39.5,42.39 C22.2 ; 38.99,40.8 34.54,40.8 ; C23.2 26.6,41.44 23.88,41.44 22.1,43.21 R14.1 17.64,45.9 17.02,46.52 17.02,48.99 C4.1 17.01,49.12 C3.1 ; C23.2 26.67,36.78 25.48,35.6 16.38,35.6 16.13,35.34 v1(12.95,35.34) ; C23.2 C24.2 31.94,41.37 32.51,40.8 34.54,40.8 ; 15.78,14.22 17.02,12.99 C8.1 ; 15.78,14.22 SW2.2 SW2.1 6.1,14.61 GND.1 6.22,20.35 J3.1 J3.2 ; 34.54,40.8 34.99,41.25 C21.2 ; v1(32,90.71) 32,88.23 C19.1 33.4,88.17 C17.1 C18.1 37.73,88.57 U2.1 ; R15.2 51.55,76.61 J4.2 ; LED1.2 LED2.2 15.58,86.86 v1(15.62,86.9) 15.88,86.9 19.3,83.47 v1(19.3,82.46) ; LED1.2 7.58,86.86 J2.1 ; J4.1 51.69,83.09 50.48,84.3 50.48,87.92 48.58,89.82 43.69,89.82 42.43,88.57 U2.1 ; PWR.2 41.57,102.95 CN1.2 41.57,89.93 U2.1
  Bottom Layer w0.254: v1(22.48,67.09) 22.48,75.09 22.1,75.47 ; v1(45.72,75.73) 45.72,73.44 45.39,73.11 45.39,62.31 v1(45.34,62.26) ; v1(42.42,62.26) 42.4,62.29 42.4,55.51 v1(41.53,54.64) 41.53,53.63 40.51,52.61 40.51,49.69 v1(40.13,49.31)
  Bottom Layer w0.762: H1.1 22.1,75.47 19.3,78.27 v1(19.3,82.46) ; P3.4 32,90.79 v1(32,90.71) ; J3.2 8.76,31.78 12.32,35.34 v1(12.95,35.34)
  vias: v1(2.92,88.55) v1(2.92,84.87) v1(4.06,84.87) v1(4.44,88.55) v1(11.81,5.24) v1(12.06,66.2) v1(12.06,63.92) v1(18.41,25.05) v1(18.56,22.13) v1(21.08,38.52) v1(23.75,39.66) v1(25.02,22.13) v1(25.38,25.05) v1(26.8,4.86) v1(28.19,81.57) v1(28.19,79.03) v1(34.42,83.6) v1(37.85,83.6) v1(38.74,21.88) v1(40.13,25.05) v1(41.81,4.86) v1(43.05,17.69) v1(43.81,44.61) v1(43.81,39.4) v1(49.02,17.81) v1(49.15,24.93) v1(49.91,21.88) v1(51.82,4.61)
BOOT0: length 140.8
  Top Layer w0.254: CN1.6 44.73,91.09 v1(42.8,91.09) ; U1.60 24.01,56.8 15.37,56.8 v1(14.99,56.42) ; v1(22.1,41.69) 20.5,40.1 15.82,40.1 11.76,36.04 11.76,32.48 12,32.24 20.76,32.24 21.73,31.28 v1(28.07,31.28) ; v1(23.5,43.34) 23.5,46.01 R14.2 v1(23.62,47.41)
  Bottom Layer w0.254: v1(22.1,41.69) 23.5,43.09 v1(23.5,43.34) ; v1(42.8,91.09) 42.8,88.68 41.28,87.16 22.11,87.16 16.76,81.81 16.76,58.2 v1(14.99,56.42) 23.62,47.79 v1(23.62,47.41) ; v1(28.07,31.28) 28.19,31.15 28.96,31.15 30.48,32.67 30.48,36.1 29.97,36.61 P1.2
JTCK: length 88.7
  Top Layer w0.254: 12.7,103.16 v1(12.69,103.15) R22.2 ; J2.11 v1(6.5,57.31) 7.49,57.31 8.51,58.33 8.51,61.38 9.46,62.33 20.26,62.33 20.32,62.39 20.38,62.33 U1.49
  Bottom Layer w0.254: 6.48,57.31 6.48,87.41 7.24,88.17 17.78,88.17 19.3,89.7 19.3,95.92 19.33,95.92 P3.9 19.23,98.48 17.36,98.48 v1(12.69,103.15)
JTDI: length 86.5
  Top Layer w0.254: R5.2 25.64,99.75 P3.5 ; U1.50 9.98,61.83 9.27,61.12 9.27,55.41 8.64,54.77 v1(8.25,54.77) J2.12
  Bottom Layer w0.254: v1(8.25,54.77) 8.25,83.22 9.02,83.98 17.15,83.98 24.38,91.22 24.38,95.54 25.64,96.8 P3.5
JTDO: length 105.1
  Top Layer w0.254: J2.17 3.56,42.2 11.43,42.2 12.19,42.96 12.19,58.45 13.07,59.33 U1.55 ; R30.2 15.48,101.27 P3.13
  Bottom Layer w0.254: J2.17 5.72,44.36 5.72,88.17 6.86,89.31 12.95,89.31 14.22,90.58 14.22,95.9 P3.13
JTMS: length 88.1
  Top Layer w0.254: R31.2 23.1,97.97 P3.7 ; J2.10 7.49,59.85 8,60.36 8,66.45 9.53,67.98 25.27,67.98 26.84,66.41 U1.46
  Bottom Layer w0.254: P3.7 21.84,95.9 21.84,89.95 18.54,86.65 18.41,86.65 17.78,86.01 9.14,86.01 7.37,84.23 v1(7.37,59.98)
JTRST: length 112.4
  Top Layer w0.254: U1.56 13.46,58.83 12.7,58.07 12.7,42.45 9.78,39.53 v1(8.89,39.53) J2.18 ; R9.2 28.18,101.53 P3.3
  Bottom Layer w0.254: v1(8.89,39.53) 8.89,82.2 9.27,82.58 16.89,82.58 26.92,92.62 26.92,95.9 P3.3
KEY1: length 68.7
  Top Layer w0.254: v1(21.84,9.43) 21.77,9.5 R1.1 19.19,9.61 C8.2 14.22,9.61 SW2.4 SW2.3 ; v1(29.84,50.83) 29.84,50.84 U1.9
  Bottom Layer w0.254: v1(21.84,9.43) 24,11.59 28.75,11.59 29.08,11.92 J3.10 27.18,29.5 27.18,50.2 27.81,50.83 v1(29.84,50.83)
KEY2: length 76.2
  Top Layer w0.254: v1(29.84,55.15) 30.34,54.66 U1.10 ; R2.1 55.32,9.69 53.85,9.69 53.81,9.72 SW1.4 SW1.3 39.32,7.27 v1(31.62,7.27)
  Bottom Layer w0.254: v1(29.84,55.15) 30.35,54.64 30.35,51.34 31.62,50.07 31.62,37.88 32,37.5 32,27.97 J3.11 v1(31.62,7.27)
KEY3: length 63.3
  Top Layer w0.254: SW3.4 32.76,9.61 C10.2 38.12,9.61 R3.1 ; SW3.4 SW3.3 ; SW3.4 32.65,11.46 v1(32.64,11.46) ; v1(32.38,55.79) 32.38,54.41 32.34,54.36 U1.14
  Bottom Layer w0.254: v1(32.38,55.79) 32.38,49.31 32.93,48.76 32.93,25.47 32.64,25.18 v1(32.64,11.46)
LED1: length 166.7
  Top Layer w0.254: 35.14,58.33 48.13,58.33 48.77,57.69 48.77,39.66 50.93,37.5 55.37,37.5 J4.19 56.73,36.14 56.73,25.27 55.12,23.66 v1(27.43,23.66) ; 9.42,81.31 10.03,80.7 v1(10.03,79.03)
  Bottom Layer w0.254: v1(27.43,23.66) 27.31,23.78 3.81,23.78 3.17,24.42 3.17,28.1 10.03,34.96 v1(10.03,79.03)
LED2: length 77.1
  Top Layer w0.254: v1(15.88,71.92) 21.08,71.92 v1(21.21,72.04) ; R29.1 13.22,79.53 v1(13.84,78.9) ; J4.18 50.67,39.91 49.4,41.18 49.4,58.33 48.9,58.83 33.81,58.83 33.69,58.71 v1(32,58.71)
  Bottom Layer w0.254: v1(32,58.71) 30.73,58.71 27.94,61.5 25.78,61.5 21.84,65.44 21.84,71.41 v1(21.21,72.04) ; v1(15.88,71.92) 13.84,73.95 v1(13.84,78.9)
NRST: length 133.8
  Top Layer w0.254: P3.15 12.94,101.37 13.59,102.02 13.59,104.81 13.72,104.94 v1(34.93,104.94) ; v1(20.96,82.97) 13.59,90.33 v1(11.68,90.33) ; C13.2 41.15,33.18 34.29,33.18 33.58,33.89 RST.1 32.83,35.46 R4.1 31.62,36.61 v1(31.12,37.12) ; v1(29.72,60.61) 29.72,58.71 28.84,57.83 U1.7 28.84,50.31 v1(29.08,50.07)
  Bottom Layer w0.254: v1(34.93,104.94) 44.7,104.94 49.07,100.57 CN1.5 ; v1(20.96,82.97) 23.11,80.81 23.11,64.82 25.97,61.96 28.37,61.96 v1(29.72,60.61) 29.72,60.49 ; v1(31.12,37.12) 31.12,48.04 v1(29.08,50.07) ; v1(11.68,90.33) 11.68,95.9 P3.15
OLED_CS: length 47.8
  Top Layer w0.254: U1.33 33.34,65.25 34.16,66.07 v1(36.96,66.07) 49.66,66.07 52.58,63.15 52.58,56.04 53.47,55.15 J4.12 ; v1(34.54,72.42) H1.6 37.08,78.27 R24.1
  Bottom Layer w0.254: v1(34.54,72.42) 34.54,69.76 36.96,67.34 v1(36.96,66.07)
OLED_DC: length 56.6
  Top Layer w0.254: H1.4 30.35,74.84 v1(30.35,70.27) ; v1(35.81,50.07) 31.22,50.07 31.22,50.08 30.84,50.47 U1.11 30.84,54.36 30.8,54.41 30.8,54.85 30.61,55.04 v1(30.61,56.3)
  Bottom Layer w0.254: v1(30.61,56.3) 33.53,59.22 33.53,60.61 30.35,63.79 v1(30.35,70.27) ; J3.12 35.81,29.24 v1(35.81,50.07)
OLED_DIN: length 59
  Top Layer w0.254: v1(28.57,70.77) 28.57,71.53 H1.2 20.57,79.54 R27.1 ; v1(31.88,59.6) 31.88,60.87 31.84,60.9 U1.36 31.84,66.55 34.29,69 49.28,69 J4.9
  Bottom Layer w0.254: v1(31.88,59.6) 28.57,62.9 v1(28.57,70.77)
OLED_RES: length 44.1
  Top Layer w0.254: v1(32.38,71.15) 32,71.53 H1.5 34.54,78.27 R25.1 ; U1.35 32.34,66.16 33.78,67.6 v1(35.31,67.6) 49.66,67.6 53.59,63.66 53.59,62.14 J4.10
  Bottom Layer w0.254: v1(32.38,71.15) 35.31,68.23 v1(35.31,67.6)
OLED_SCK: length 59.2
  Top Layer w0.254: R26.1 26.67,75.73 H1.3 29.59,73.06 v1(29.59,71.28) ; J4.11 53.59,57.69 53.09,58.2 53.09,63.41 49.53,66.96 34.04,66.96 32.84,65.77 U1.34 32.84,62.8 32.89,62.75 v1(32.89,60.23)
  Bottom Layer w0.254: v1(32.89,60.23) 29.59,63.53 v1(29.59,71.28)
OSC32_IN: length 10.3
  Top Layer w0.254: U1.3 26.84,47.07 U4.1 26.79,42.89 C23.1
OSC32_OUT: length 11.2
  Top Layer w0.254: U1.4 27.34,49.03 29.72,46.65 C24.1
OSC_IN: length 15.7
  Top Layer w0.254: U1.5 27.84,49.28 28.7,48.42 33.08,48.42 U3.2 33.84,42.71 C21.1
OSC_OUT: length 19.7
  Top Layer w0.254: C22.1 38.54,42.83 U3.1 36.77,49.44 28.7,49.44 28.34,49.8 U1.6
PA1: length 41.4
  Top Layer w0.254: J3.14 39.24,31.4 40,32.17 43.94,32.17 45.21,33.44 45.21,50.07 43.83,51.45 33.42,51.45 32.84,52.03 U1.15
PA2: length 39.7
  Top Layer w0.254: U1.16 33.34,52.42 33.85,51.91 44.52,51.91 45.72,50.71 45.72,33.05 44.32,31.66 42.16,31.66 41.78,31.28 J3.15
PA3: length 34.1
  Top Layer w0.254: v1(42.04,53.12) 40.32,54.83 35.14,54.83
  Bottom Layer w0.254: J3.16 42.04,29.88 v1(42.04,53.12)
PA4: length 39.8
  Top Layer w0.254: J3.17 46.86,34.96 46.23,35.59 46.23,55.91 45.81,56.33 35.14,56.33
PA5: length 41.5
  Top Layer w0.254: 35.14,56.83 46.07,56.83 46.86,56.04 46.86,37.12 49.4,34.58 J3.18
PA6: length 43.6
  Top Layer w0.254: J3.19 51.94,33.94 47.5,38.39 47.5,56.8 46.97,57.33 35.14,57.33
PA7: length 40.7
  Top Layer w0.254: 35.14,57.83 47.49,57.83 48.13,57.18 48.13,38.64 51.94,34.83 J4.20
PA8: length 32
  Top Layer w0.254: U1.41 29.34,68.61 27.05,70.9 7.62,70.9 5.97,72.55 J2.5
PA9: length 49.4
  Top Layer w0.254: R6.1 17.79,65.19 R7.2 17.91,65.06 v1(17.91,63.41) ; v1(26.16,60.99) 28.83,60.99 28.84,61.01 U1.42 28.84,68.35 26.8,70.39 3.81,70.39 J2.6
  Bottom Layer w0.254: v1(17.91,63.41) 20.45,60.87 23.37,60.87 23.5,60.99 v1(26.16,60.99)
PA10: length 49.3
  Top Layer w0.254: R8.2 42.93,74.58 v1(41.66,73.31) ; U1.43 28.34,67.58 v1(26.42,69.5) 8.51,69.5 6.48,67.47 J2.7
  Bottom Layer w0.254: 26.29,69.5 30.1,73.31 v1(41.66,73.31)
PA11: length 30.7
  Top Layer w0.254: U1.44 27.84,66.95 25.84,68.94 8.84,68.94 6.86,66.97 6.86,65.32 6.48,64.93 J2.8
PA12: length 32
  Top Layer w0.254: J2.9 7.11,62.39 7.49,62.77 7.49,66.71 9.27,68.49 25.53,68.49 27.34,66.67 U1.45
PB0: length 35.4
  Top Layer w0.254: 35.14,59.33 49.29,59.33 49.91,58.71 49.91,44.99 52.45,42.45 J4.17
PB1: length 33.1
  Top Layer w0.254: 35.14,59.83 49.8,59.83 50.42,59.22 50.42,48.04 53.47,44.99 J4.16
PB2: length 66.9
  Top Layer w0.254: 35.14,60.33 50.32,60.33 51.05,59.6 51.05,49.56 53.09,47.53 J4.15 ; R15.1 v1(44.7,73.57)
  Bottom Layer w0.254: v1(44.7,73.57) 44.07,72.93 44.07,54.14 50.67,47.53 J4.15
PB5: length 38.5
  Top Layer w0.254: U1.57 13.85,58.33 13.34,57.82 13.34,42.33 9.53,38.52 6.35,38.52 4.83,36.99 J2.19
PB6: length 39.4
  Top Layer w0.254: J2.20 6.6,37.63 9.65,37.63 13.84,41.82 13.84,57.44 14.24,57.83 U1.58
PB7: length 46.5
  Top Layer w0.254: J3.5 16.38,29.88 15.62,30.64 10.79,30.64 10.03,31.4 10.03,36.86 14.35,41.18 14.35,56.93 14.78,57.36 24.01,57.36 U1.59
PB8: length 46.2
  Top Layer w0.254: J3.6 18.92,30.39 18.03,31.28 11.43,31.28 10.79,31.91 10.79,36.61 14.99,40.8 14.99,55.41 15.88,56.3 24.01,56.3 U1.61
PB9: length 47.5
  Top Layer w0.254: J3.7 21.46,30.9 20.57,31.78 11.81,31.78 11.3,32.29 11.3,36.23 15.49,40.42 15.49,55.15 16.17,55.83 U1.62
PB10: length 29.3
  Top Layer w0.254: 35.14,60.83 50.71,60.83 51.56,59.98 51.56,52.36 53.72,50.2 55.37,50.2 J4.14
PB11: length 27.5
  Top Layer w0.254: 35.14,61.33 50.97,61.33 52.07,60.23 52.07,54.14 53.59,52.61 J4.13
PC0: length 37.5
  Top Layer w0.254: v1(30.1,57.82) 30.1,56.71 29.34,55.95 U1.8
  Bottom Layer w0.254: J3.9 26.54,55.53 28.83,57.82 v1(30.1,57.82)
PC6: length 29.9
  Top Layer w0.254: U1.37 31.34,66.81 34.29,69.76 49.53,69.76 53.72,65.57 55.25,65.57 J4.8
PC7: length 30.2
  Top Layer w0.254: J4.7 55.37,67.72 53.34,67.72 50.55,70.52 34.29,70.52 30.84,67.07 U1.38
PC8: length 30.1
  Top Layer w0.254: U1.39 30.34,65.3 30.38,65.34 30.38,67.26 34.2,71.08 54.81,71.08 J4.6
PC9: length 31.9
  Top Layer w0.254: U1.40 29.84,67.47 33.91,71.53 52.2,71.53 52.2,72.55 52.58,72.93 J4.5
PC10: length 28.9
  Top Layer w0.254: J2.13 9.14,52.23 9.91,52.99 9.91,60.74 10.5,61.33 U1.51
PC11: length 30.8
  Top Layer w0.254: U1.52 11.27,60.83 10.54,60.11 10.54,50.58 9.65,49.69 J2.14
PC12: length 32.9
  Top Layer w0.254: U1.53 12.04,60.33 11.18,59.47 11.18,47.79 10.54,47.15 J2.15
PC13: length 26.4
  Top Layer w0.254: v1(24.89,50.33) 26.34,51.77 U1.2
  Bottom Layer w0.254: v1(24.89,50.33) 24.89,28.48 J3.8
PD2: length 35
  Top Layer w0.254: U1.54 12.55,59.83 11.68,58.96 11.68,45.12 11.18,44.61 J2.16
USART1_RX: length 21.8
  Top Layer w0.254: v1(42.93,80.93) R8.1
  Bottom Layer w0.254: v1(42.93,80.93) 44.07,82.08 44.07,97.93 CN1.3
USART1_TX: length 53.1
  Top Layer w0.254: v1(25.27,65.19) 19.29,65.19
  Bottom Layer w0.254: v1(25.27,65.19) 25.27,69.5 29.59,73.82 38.61,73.82 41.78,77 41.78,77.89 46.86,82.97 46.86,97.65 CN1.4
$1N6990: length 25.4
  Top Layer w0.254: v1(20.07,53.88) 20.07,52.04 L1.2 C3.2 18.41,49.12 C4.2 ; v1(31.24,58.07) 31.24,56.04 31.84,55.44 U1.13
  Bottom Layer w0.254: v1(20.07,53.88) 25.02,58.83 29.84,58.83 30.61,58.07 v1(31.24,58.07)
$1N7842: length 19.5
  Top Layer w0.254: v1(49.28,83.98) 49.26,83.97 U2.3 ; v1(51.94,85.5) 51.94,87.86 C16.2 54.13,90.16 D1.1
  Bottom Layer w0.254: v1(49.28,83.98) 50.42,83.98 v1(51.94,85.5)
$1N8958: length 14.6
  Top Layer w0.254: L2.1 33.53,85.38 C17.2 C18.2 39.95,86.01 U2.2 U2.4
$1N13058: length 7.9
  Top Layer w0.254: PWR.1 44.39,104.23 43.31,105.32 39.99,105.32 R17.2
$1N53053: length 4.2
  Top Layer w0.254: R28.2 10.92,84.4 LED1.1
$1N53386: length 4.3
  Top Layer w0.254: R29.2 14.72,84.15 LED2.1

## Copper pours and planes (outline as drawn; the poured copper is in the pictures)
GND on Top Layer: -3.05,111.54 61.98,111.54 61.98,-5.3 -3.05,-5.3
GND on Bottom Layer: -2.67,110.91 61.72,110.91 61.72,-2.89 -2.67,-2.89

Small or netless copper shapes (teardrops, artwork), in the pictures only: 420 on Top Layer, 93 on Bottom Layer

## Text on the board
Bottom Silkscreen Layer: +5 | GND | USART1_RX | USART1_TX | NRST | BOOT0 | JTD0 | JTCK | JTMS | JTDI | GTRST | 3V3
Top Silkscreen Layer: JTCK | PC12 | JTD0 | JTRST | PA10 | JTMS | JTDI | PC10 | PC11 | PA12 | PB5 | PA8 | PA9 | PA11 | GND | PD2 | PB6 | 3V3 | PB10 | LED2 | LED1 | PA7 | PB11 | PB2 | PC9 | PC8 | PC7 | PC6 | RES | CS | PN1 | PB0 | SCK | DIN | PB8 | PB9 | PC13 | PC0 | KEY1 | KEY2 | _DC | AP0 | PA1 | PA2 | PA3 | PA4 | PA5 | PA6 | 宁子希
